# EAGLE schematic breakoutsch (EAGLE 6.3)
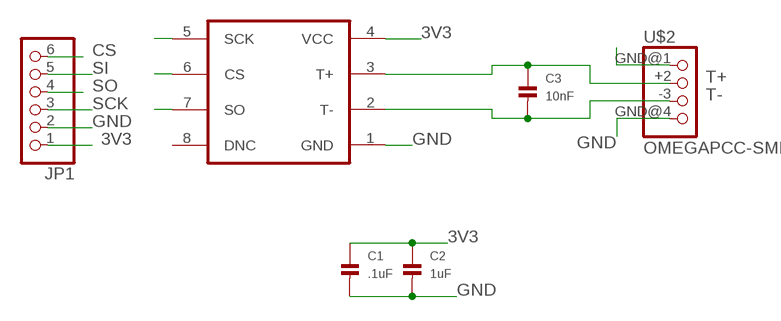
[diagram p0: schematic, sheet 1]

## Parts
C1  .1uF  CAP_CERAMIC0603  [0603]
C2  1uF  CAP_CERAMIC0603  [0603]
C3  10nF  CAP_CERAMIC0603  [0603]
JP1  HEADER-1X6ROUND  [1X06_ROUND]
U$1  MAX31855  [SO-08]
U$2  OMEGAPCC-SMP  [PCC-SMP]

## Nets
3V3: C1.1 C2.1 JP1.1 U$1.4(VCC)
CS: JP1.6 U$1.6(CS)
GND: C1.2 C2.2 JP1.2 U$1.1(GND) U$2.GND@1 U$2.GND@4
SCK: JP1.3 U$1.5(SCK)
SI: JP1.5
SO: JP1.4 U$1.7(SO)
T+: C3.1 U$1.3(T+) U$2.+2
T-: C3.2 U$1.2(T-) U$2.-3
Unconnected: U$1.8(DNC)

## Library data of the parts
C1-C3 = nonolith:CAP_CERAMIC: Ceramic Capacitors 0402 - 0402 Surface Mount Capacitors 0.1uF 10V 10% [Digikey: 490-1318-2-ND] 0603 - 0603 Surface Mount Capacitors 16 pF 50V 5% [Digikey: 445-5051-2-ND] 22 pF 50V [Digikey: PCC220ACVTR-ND] 33 pF 50V 5% [Digikey: 490-1415-1-ND] 56pF 50V 5% [Digikey: 490-1421-1-ND] 220pF 50V 5% [Digikey: 445-1285-1-ND] 680 pF 50V 2200 pF 50V 5% C0G [Digikey: 445-1297-1-ND] 5600 pF 100V 5% X7R [Digikey: 478-3711-1-ND] 0.1 µF 25V 10% [Digikey: PCC2277TR-ND] 0.22 µF 16V 10% X7R [Digikey: 445-1318-1-ND] 1.0 µF 25V 10% [Digikey: 445-5146-2-ND] 0603 - RF Specific 3pF 250V +/-0.1pF RF [Digikey: 712-1347-1-ND] 18 pF 250V 5% [Digikey: 478-3505-1-ND or 712-1322-1-ND] 56 pF 250V 5% C0G RF [Digikey: 490-4867-1-ND] 68 pF 250V RF [Digikey: 490-4868-1-ND] 0805 - 0805 Surface Mount Capacitors 220 pF 250V 2% RF Ceramic Capacitor [Digikey: 712-1398-1-ND] 1000 pF 50V 2% NP0 Ceramic Capacitor [Digikey: 478-3760-1-ND] 0.1 µF 25V 10% Ceramic Capacitor [Digikey: PCC1828TR-ND] 1.0 µF 16V 10% Ceramic Capacitor[Digikey: 490-1691-2-ND] 10.0 µF 10V 10% Ceramic Capacitor[Digikey: 709-1228-1-ND] 1206 - 1206 Surface Mount Capacitors
JP1 = nonolith:HEADER-1X6: PIN HEADER
U$1 = nonolith:MAX31855: MAX31855 thermocouple interface
U$2 = nonolith:OMEGA